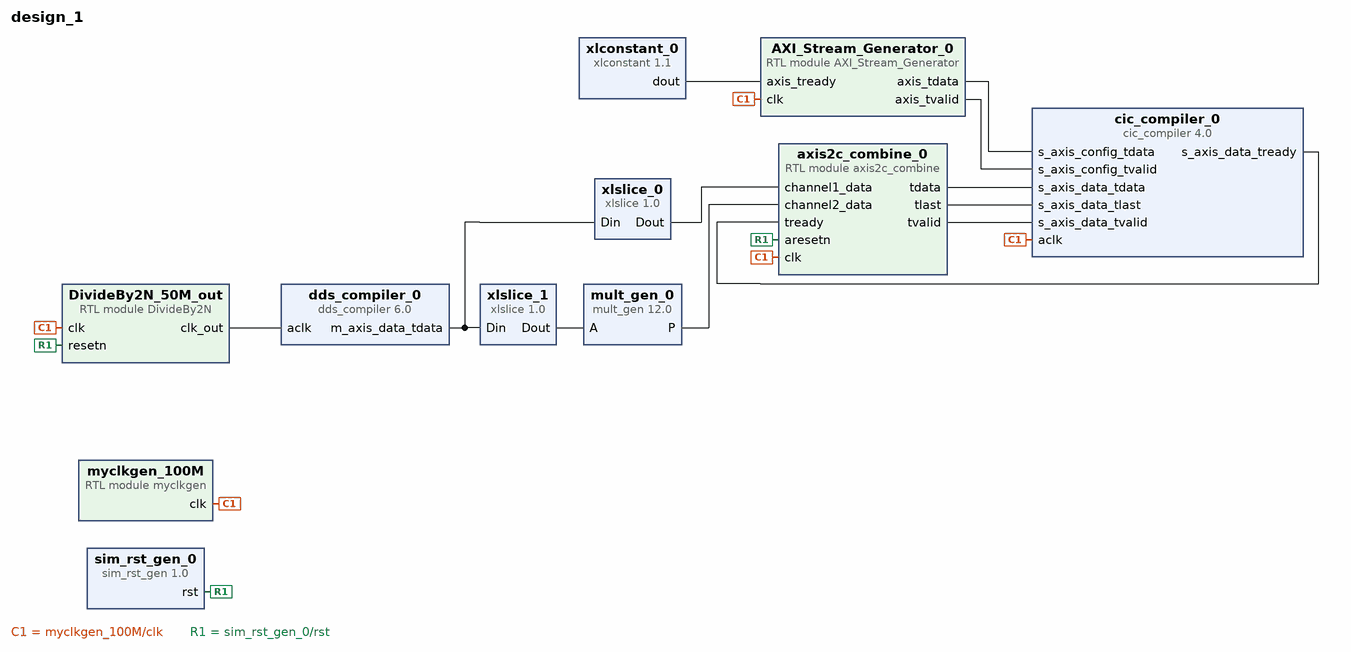
[diagram p0: block diagram of the top level]
# Vivado block design design_1, xc7z010clg400-1, Vivado 2022.2
create_bd_design design_1

create_bd_cell -type ip -vlnv xilinx.com:ip:dds_compiler:6.0 dds_compiler_0
set_property -dict [list \
  CONFIG.Channels 1 \
  CONFIG.DATA_Has_TLAST Not_Required \
  CONFIG.Frequency_Resolution 0.4 \
  CONFIG.Has_Phase_Out false \
  CONFIG.Latency 9 \
  CONFIG.M_DATA_Has_TUSER Not_Required \
  CONFIG.M_PHASE_Has_TUSER Not_Required \
  CONFIG.Noise_Shaping Auto \
  CONFIG.Output_Frequency1 0.1 \
  CONFIG.Output_Width 14 \
  CONFIG.PINC1 1000001100010010011 \
  CONFIG.Parameter_Entry System_Parameters \
  CONFIG.PartsPresent Phase_Generator_and_SIN_COS_LUT \
  CONFIG.Phase_Increment Fixed \
  CONFIG.Phase_Width 28 \
  CONFIG.Phase_offset Fixed \
  CONFIG.S_PHASE_Has_TUSER Not_Required \
  CONFIG.Spurious_Free_Dynamic_Range 80 \
] [get_bd_cells dds_compiler_0]
create_bd_cell -type ip -vlnv xilinx.com:ip:xlslice:1.0 xlslice_0
set_property -dict {CONFIG.DIN_FROM 31 CONFIG.DIN_TO 16} [get_bd_cells xlslice_0]
create_bd_cell -type ip -vlnv xilinx.com:ip:xlslice:1.0 xlslice_1
set_property -dict {CONFIG.DIN_FROM 15} [get_bd_cells xlslice_1]
create_bd_cell -type module -reference myclkgen myclkgen_100M
create_bd_cell -type module -reference DivideBy2N DivideBy2N_50M_out
set_property -dict {CONFIG.N 1 CONFIG.WIDTH 2} [get_bd_cells DivideBy2N_50M_out]
create_bd_cell -type ip -vlnv xilinx.com:ip:sim_rst_gen:1.0 sim_rst_gen_0
create_bd_cell -type module -reference axis2c_combine axis2c_combine_0
create_bd_cell -type ip -vlnv xilinx.com:ip:mult_gen:12.0 mult_gen_0
set_property -dict [list \
  CONFIG.ConstValue 2 \
  CONFIG.MultType Constant_Coefficient_Multiplier \
  CONFIG.OutputWidthHigh 15 \
  CONFIG.PortAWidth 16 \
  CONFIG.Use_Custom_Output_Width true \
] [get_bd_cells mult_gen_0]
create_bd_cell -type module -reference AXI_Stream_Generator AXI_Stream_Generator_0
set_property -dict [list \
  CONFIG.DATA_0 0x00000002 \
  CONFIG.DATA_1 0x00000004 \
  CONFIG.DATA_2 0x00000008 \
  CONFIG.DATA_3 0x00000010 \
  CONFIG.TIMEOUT_0 3000 \
  CONFIG.TIMEOUT_1 3000 \
  CONFIG.TIMEOUT_2 3000 \
  CONFIG.TIMEOUT_3 3000 \
] [get_bd_cells AXI_Stream_Generator_0]
create_bd_cell -type ip -vlnv xilinx.com:ip:xlconstant:1.1 xlconstant_0
create_bd_cell -type ip -vlnv xilinx.com:ip:cic_compiler:4.0 cic_compiler_0
set_property -dict [list \
  CONFIG.Clock_Frequency 100 \
  CONFIG.Filter_Type Decimation \
  CONFIG.Input_Data_Width 16 \
  CONFIG.Input_Sample_Frequency 50 \
  CONFIG.Maximum_Rate 2048 \
  CONFIG.Minimum_Rate 4 \
  CONFIG.Number_Of_Channels 2 \
  CONFIG.Output_Data_Width 49 \
  CONFIG.Quantization Truncation \
  CONFIG.SamplePeriod 1 \
  CONFIG.Sample_Rate_Changes Programmable \
] [get_bd_cells cic_compiler_0]

# ---- connections ----

connect_bd_net [get_bd_pins AXI_Stream_Generator_0/axis_tdata] [get_bd_pins cic_compiler_0/s_axis_config_tdata]
connect_bd_net [get_bd_pins AXI_Stream_Generator_0/axis_tvalid] [get_bd_pins cic_compiler_0/s_axis_config_tvalid]
connect_bd_net [get_bd_pins DivideBy2N_50M_out/clk_out] [get_bd_pins dds_compiler_0/aclk]
connect_bd_net [get_bd_pins axis2c_combine_0/tdata] [get_bd_pins cic_compiler_0/s_axis_data_tdata]
connect_bd_net [get_bd_pins axis2c_combine_0/tlast] [get_bd_pins cic_compiler_0/s_axis_data_tlast]
connect_bd_net [get_bd_pins axis2c_combine_0/tvalid] [get_bd_pins cic_compiler_0/s_axis_data_tvalid]
connect_bd_net [get_bd_pins cic_compiler_0/s_axis_data_tready] [get_bd_pins axis2c_combine_0/tready]
connect_bd_net [get_bd_pins dds_compiler_0/m_axis_data_tdata] [get_bd_pins xlslice_0/Din] [get_bd_pins xlslice_1/Din]
connect_bd_net [get_bd_pins mult_gen_0/P] [get_bd_pins axis2c_combine_0/channel2_data]
connect_bd_net -net myclkgen_0_clk [get_bd_pins myclkgen_100M/clk] \
  [get_bd_pins DivideBy2N_50M_out/clk] [get_bd_pins axis2c_combine_0/clk] [get_bd_pins AXI_Stream_Generator_0/clk] \
  [get_bd_pins cic_compiler_0/aclk]
connect_bd_net [get_bd_pins sim_rst_gen_0/rst] [get_bd_pins DivideBy2N_50M_out/resetn] [get_bd_pins axis2c_combine_0/aresetn]
connect_bd_net [get_bd_pins xlconstant_0/dout] [get_bd_pins AXI_Stream_Generator_0/axis_tready]
connect_bd_net [get_bd_pins xlslice_0/Dout] [get_bd_pins axis2c_combine_0/channel1_data]
connect_bd_net [get_bd_pins xlslice_1/Dout] [get_bd_pins mult_gen_0/A]

validate_bd_design
save_bd_design
